# Altium schematic sheet 18B_ETHERNET CARD.SchDoc
size 297 x 209 mm
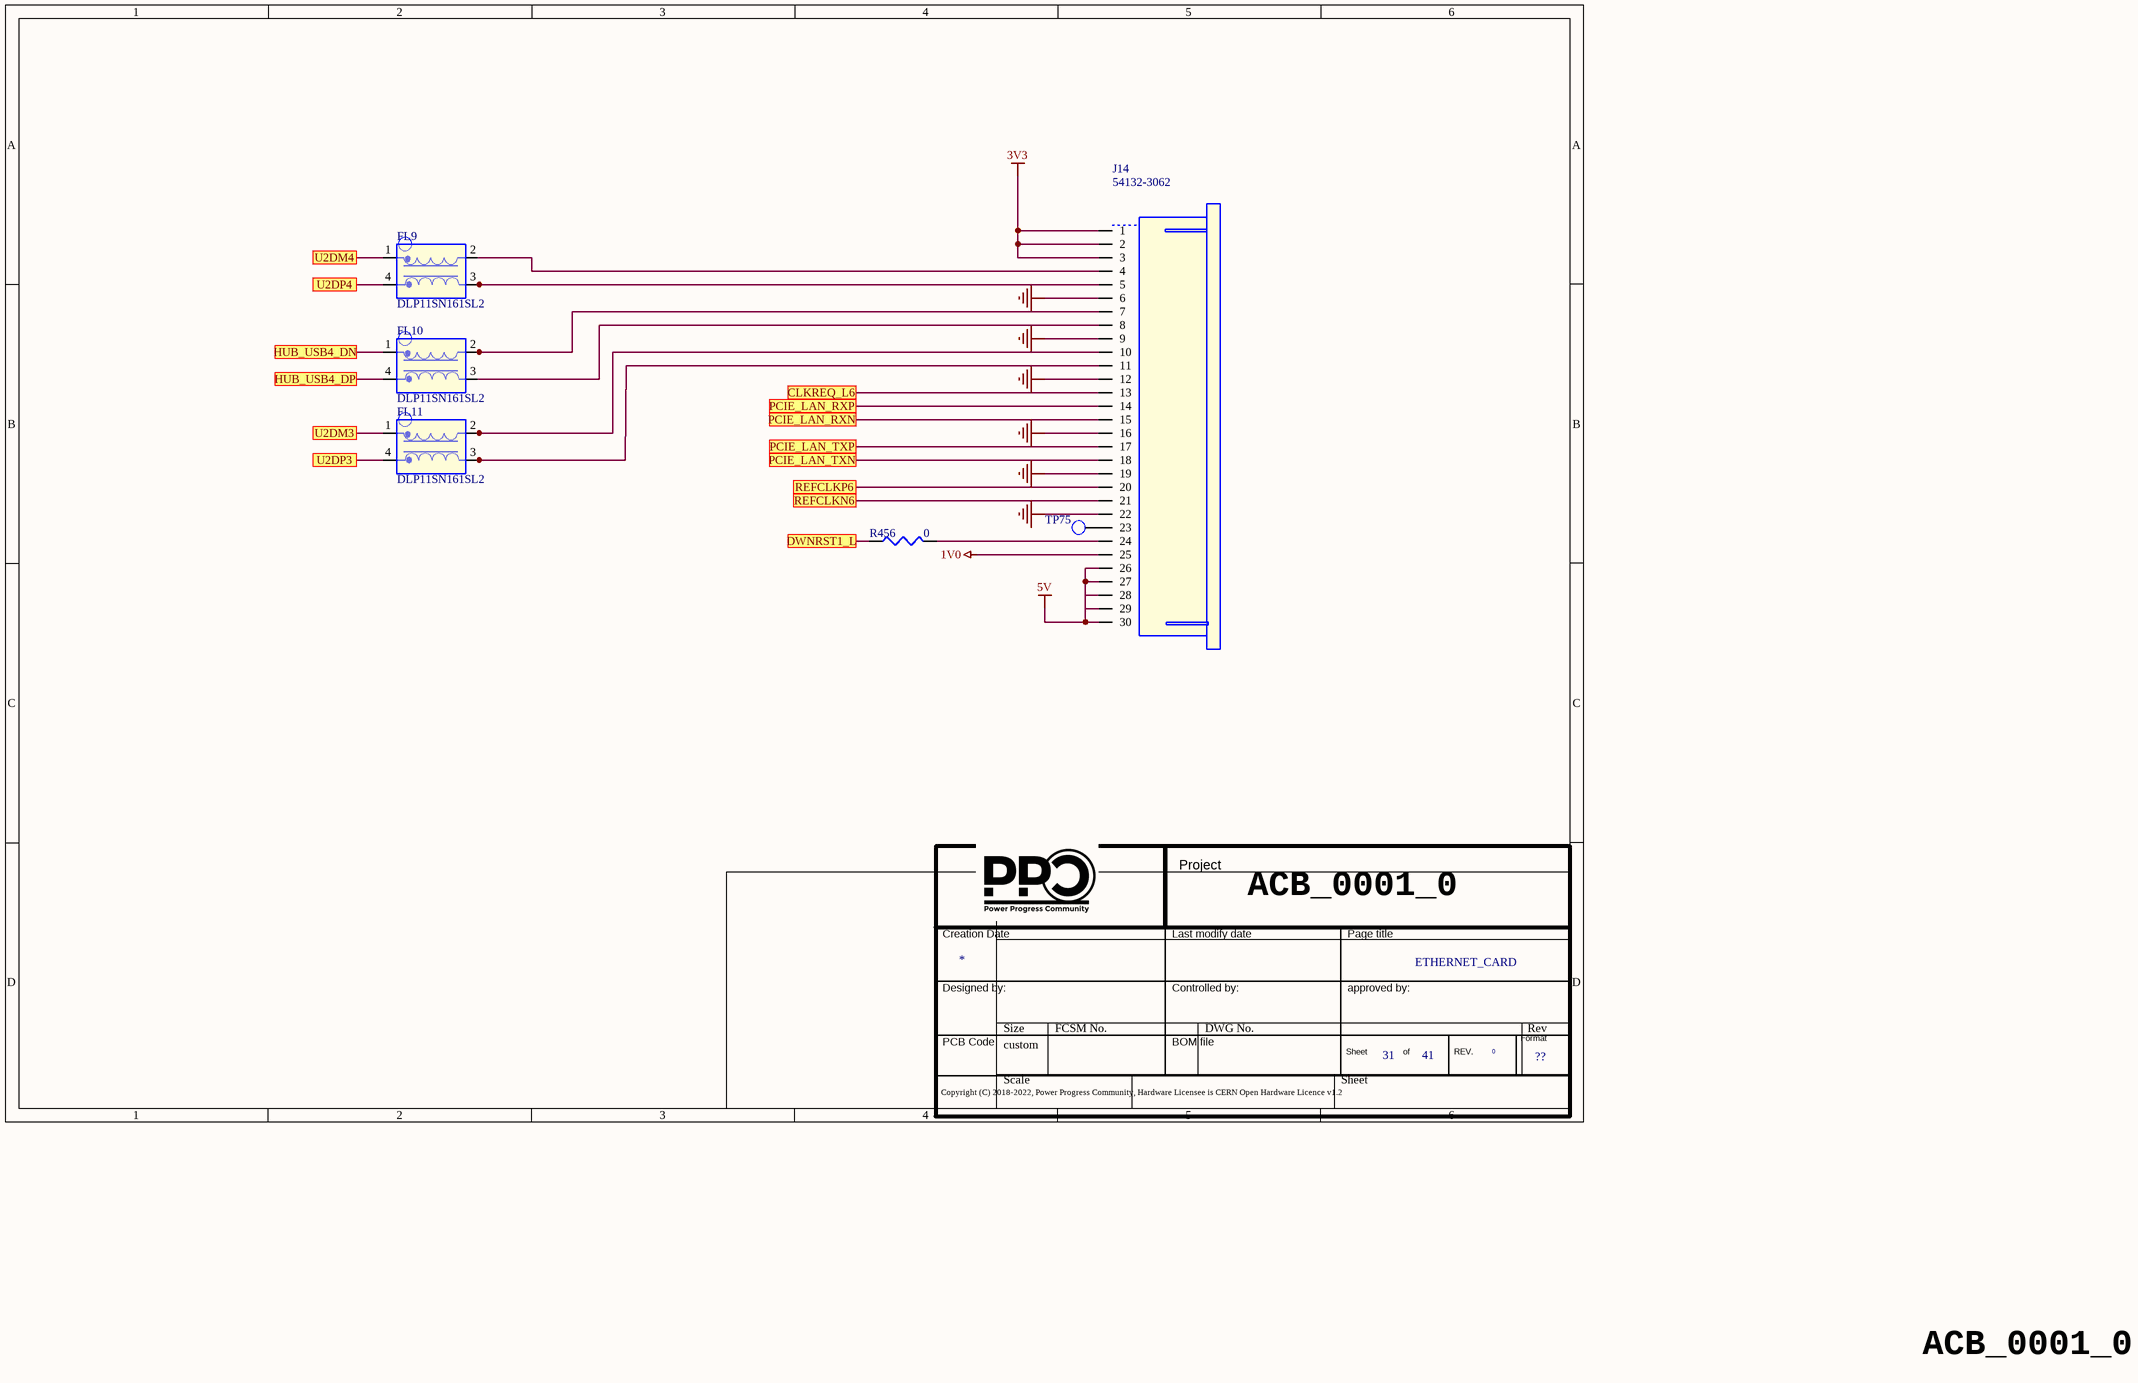
[diagram p0: 18B_ETHERNET CARD.SchDoc]

## Parts
*  Doc: ETHERNET_CARD  Page Count: 41  Page Number: 31  Page Size: ??  RevCode: 0  (hidden comment: Title_block_PPC)  (graphical)
FL9  DLP11SN161SL2  [SMD]
FL10  DLP11SN161SL2  [SMD]
FL11  DLP11SN161SL2  [SMD]
J14  54132-3062  [30 PIN PASSO 0.5mm]
R456  0  [SMD_0402]
TP75  TEST POINT  [PCB]  (value not drawn)

## Ports
CLKREQ_L6, DWNRST1_L, HUB_USB4_DN, HUB_USB4_DP, PCIE_LAN_RXN, PCIE_LAN_RXP, PCIE_LAN_TXN, PCIE_LAN_TXP, REFCLKN6, REFCLKP6, U2DM3, U2DM4, U2DP3, U2DP4

## Nets
1V0: J14.25
3V3: J14.1 J14.2 J14.3
5V: J14.26 J14.27 J14.28 J14.29 J14.30
GND: J14.6 J14.9 J14.12 J14.16 J14.19 J14.22
CLKREQ_L6: J14.13 ; port CLKREQ_L6
DWNRST1_L: R456.1 ; port DWNRST1_L
HUB_USB4_DN: FL10.1 ; port HUB_USB4_DN
HUB_USB4_DP: FL10.4 ; port HUB_USB4_DP
PCIE_LAN_RXN: J14.15 ; port PCIE_LAN_RXN
PCIE_LAN_RXP: J14.14 ; port PCIE_LAN_RXP
PCIE_LAN_TXN: J14.18 ; port PCIE_LAN_TXN
PCIE_LAN_TXP: J14.17 ; port PCIE_LAN_TXP
REFCLKN6: J14.21 ; port REFCLKN6
REFCLKP6: J14.20 ; port REFCLKP6
U2DM3: FL11.1 ; port U2DM3
U2DM4: FL9.1 ; port U2DM4
U2DP3: FL11.4 ; port U2DP3
U2DP4: FL9.4 ; port U2DP4
NetFL9_2: FL9.2 J14.4
NetFL9_3: FL9.3 J14.5
NetFL10_2: FL10.2 J14.7
NetFL10_3: FL10.3 J14.8
NetFL11_2: FL11.2 J14.10
NetFL11_3: FL11.3 J14.11
NetJ14_23: J14.23 TP75.1(TP)
NetJ14_24: J14.24 R456.2

## Notes on the sheet
- ACB_0001_0
- (in symbol Title_block_PPC) Project; Creation Date; Last modify date; Page title; Designed by:; Controlled by:; approved by:; PCB Code; BOM file; Format; Sheet; of; REV.; Copyright (C) 2018-2022, Power Progress Community, Hardware Licensee is CERN Open Hardware Licence v1.2

## Library data of the parts
* = Title_block_PPC: Title: T2080PCIe; Author: MICETEK; Page Create Date: March  8, 1995; Page Title: ?; Page Modify Date: *
FL9 FL11 = USB_CHOKE: CHOKE COMMON MODE 90 OHM 0805; Manufacturer Part Number 1: DLW21HN900SQ2L; Manufacturer 1: Murata; Part Number: PASSIVE_1366; RSM: EMI-DLW21; Distributor 1: DIGIKEY(490-1064-1-ND); Part Type: FILTER; PCB Footprint: SMD
FL10 = USB_CHOKE: CHOKE COMMON MODE 90 OHM 0805; Part Number: PASSIVE_1366; Manufacturer 1: Murata; Manufacturer Part Number 1: DLW21HN900SQ2L; RSM: EMI-DLW21; Part Type: FILTER; Distributor 1: DIGIKEY(490-1064-1-ND); PCB Footprint: SMD
J14 = ZIF_30: CONN FPC/FFC .50mm 30 pos bot contact; Part Number: CONNECTORS_593; VAL: 54132-4097; FAB: MOLEX; BOI: 40 pins; DESIG: FPC CONNECTOR ZIP; DEV: JFS_54132ZIF40P_01; RSM: MOLEX-54132-060-30; REF: 54132-4097; PCB Footprint: 30 PIN PASSO 0.5mm; Distributor 1: MOUSER(538-54132-3062); Manufacturer Part Number 1: 54132-3062; Manufacturer 1: MOLEX; Part Type: ZIF
R456 = R_Dup6: RESIS.CHIP 0R 5% 0402 SMD; Manufacturer 1: ROYAL OHM; Part Number: PASSIVE_805; RSM: RC0402; Manufacturer Part Number 1: RESIS.CHIP 0R 5% 0402 SMD; Part Type: Resistors\Fixed\SMD\0402\5%; PCB Footprint: SMD_0402
TP75 = T POINT R: TEST POINT SU PCB; Part Number: CONNECTORS_542; RSM: AE-TESTPOINT; Part Type: Tpoint; PCB Footprint: PCB